# EAGLE design minimalDuino108 (EAGLE 7.4.0)
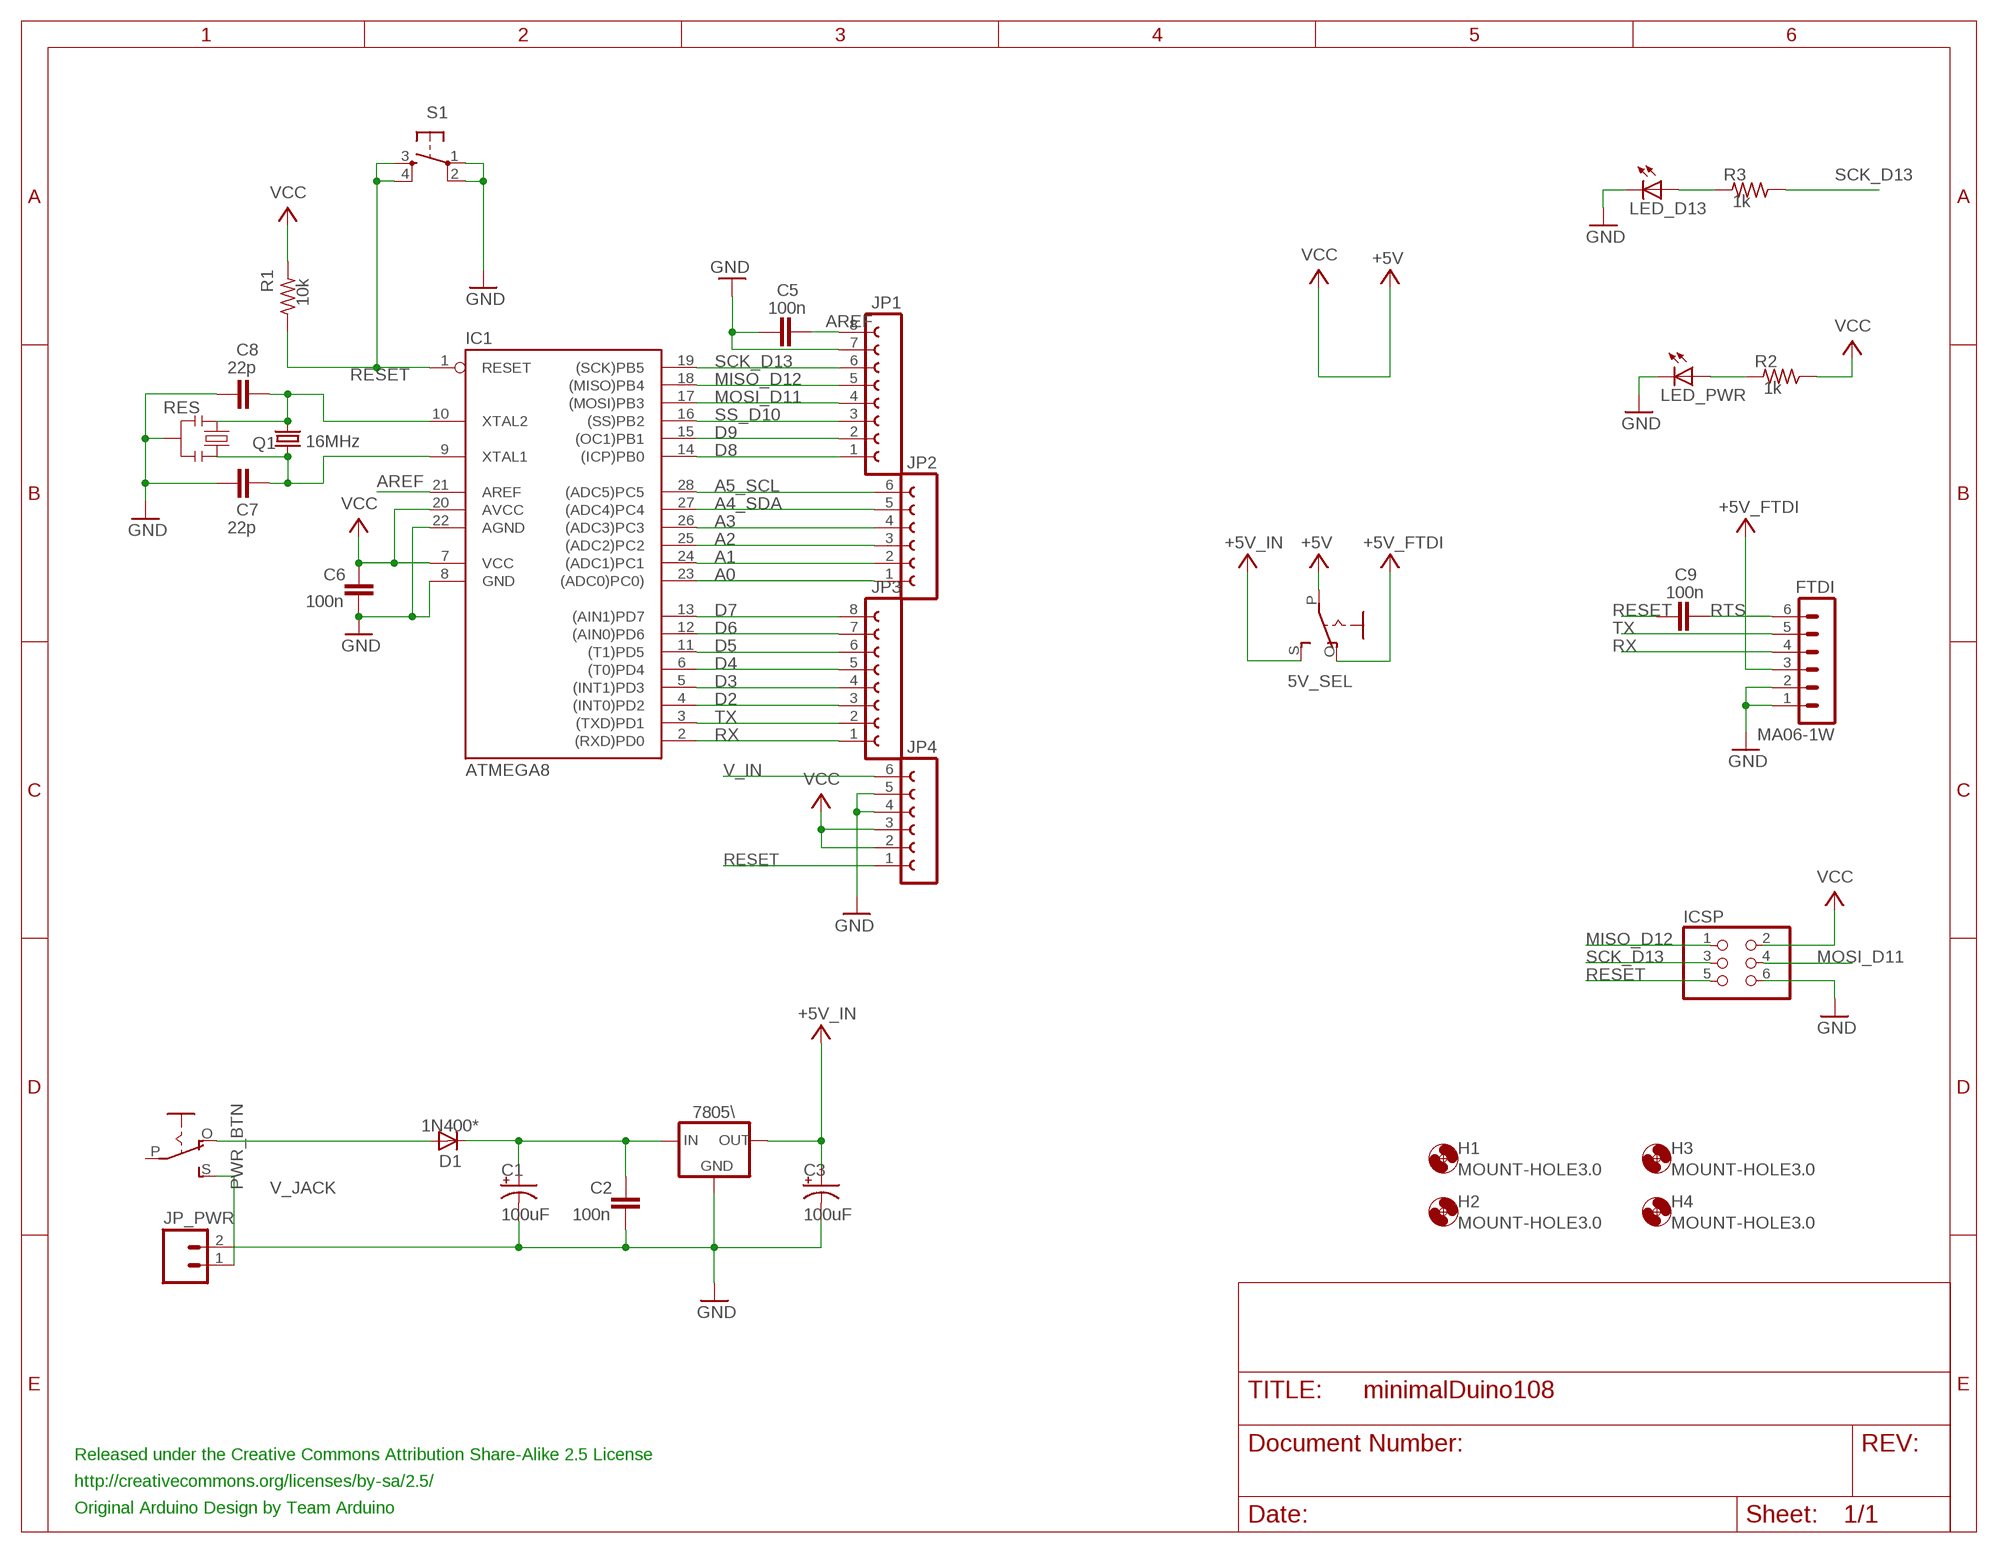
[diagram p0: schematic, sheet 1]

## Parts
5V_SEL  EG1218S  [EG1218]
7805\  V_REG_78XXSIDE  [78XXL]
C1  100uF  CPOL-USE2,5-6E  [E2,5-6E]
C2  100n  C-EU025-025X050  [C025-025X050]
C3  100uF  CPOL-USE2.5-6  [E2,5-6]
C5  100n  C-EU025-025X050  [C025-025X050]
C6  100n  C-EU025-025X050  [C025-025X050]
C7  22p  C-EU025-025X050  [C025-025X050]
C8  22p  C-EU025-025X050  [C025-025X050]
C9  100n  C-EU025-025X050  [C025-025X050]
D1  1N400*  1N4148  [DO35-10]
FTDI  MA06-1W  [MA06-1W]
H1  MOUNT-HOLE3.0  [3,0]
H2  MOUNT-HOLE3.0  [3,0]
H3  MOUNT-HOLE3.0  [3,0]
H4  MOUNT-HOLE3.0  [3,0]
IC1  ATMEGA8  AT90S4433P  [DIL28-3]
ICSP  PINHD-2X3  [2X03]
JP1  FE08-1  [FE08]
JP2  FE06-1  [FE06]
JP3  FE08-1  [FE08]
JP4  FE06-1  [FE06]
JP_PWR  M02PTH  [1X02]
LED_D13  LED3MM  [LED3MM]
LED_PWR  LED3MM  [LED3MM]
PWR_BTN  EG1218S  [EG1218]
Q1  16MHz  CRYSTALHC49S  [HC49/S]
R1  10k  R-US_0204/7  [0204/7]
R2  1k  R-US_0204/7  [0204/7]
R3  1k  R-US_0204/7  [0204/7]
RES  16MHz  RESONATORPTH  [RESONATOR-PTH]
S1  TAC_SWITCHPTH  [TACTILE-PTH]

## Nets
+5V [power]: 5V_SEL.P ; supply symbol labelled VCC
+5V_FTDI [power]: 5V_SEL.O FTDI.3
+5V_IN [power]: 5V_SEL.S 7805\.OUT C3.+
A0: IC1.23((ADC0)PC0)) JP2.1
A1: IC1.24((ADC1)PC1) JP2.2
A2: IC1.25((ADC2)PC2) JP2.3
A3: IC1.26((ADC3)PC3) JP2.4
A4_SDA: IC1.27((ADC4)PC4) JP2.5
A5_SCL: IC1.28((ADC5)PC5) JP2.6
AREF [aref]: C5.2 IC1.21(AREF) JP1.8
D2: IC1.4((INT0)PD2) JP3.3
D3: IC1.5((INT1)PD3) JP3.4
D4: IC1.6((T0)PD4) JP3.5
D5: IC1.11((T1)PD5) JP3.6
D6: IC1.12((AIN0)PD6) JP3.7
D7: IC1.13((AIN1)PD7) JP3.8
D8: IC1.14((ICP)PB0) JP1.1
D9: IC1.15((OC1)PB1) JP1.2
GND: 7805\.GND C1.- C2.2 C3.- C5.1 C6.2 C7.1 C8.1 FTDI.1 FTDI.2 IC1.8(GND) IC1.22(AGND) ICSP.6 JP1.7 JP4.4 JP4.5 JP_PWR.2 LED_D13.K(C) LED_PWR.K(C) RES.2 S1.1 S1.2
MISO_D12: IC1.18((MISO)PB4) ICSP.1 JP1.5
MOSI_D11: IC1.17((MOSI)PB3) ICSP.4 JP1.4
N$1: LED_PWR.A R2.2
N$2: JP_PWR.1 PWR_BTN.S
N$4: LED_D13.A R3.2
N$6: C7.2 IC1.9(XTAL1) Q1.1 RES.3
N$8: C8.2 IC1.10(XTAL2) Q1.2 RES.1
RESET: C9.2 IC1.1(RESET) ICSP.5 JP4.1 R1.1 S1.3 S1.4
RTS: C9.1 FTDI.6
RX: FTDI.4 IC1.2((RXD)PD0) JP3.1
SCK_D13: IC1.19((SCK)PB5) ICSP.3 JP1.6 R3.1
SS_D10: IC1.16((SS)PB2) JP1.3
TX: FTDI.5 IC1.3((TXD)PD1) JP3.2
V_IN [gnd]: 7805\.IN C1.+ C2.1 D1.C JP4.6
V_JACK: D1.A PWR_BTN.O
VCC: C6.1 IC1.7(VCC) IC1.20(AVCC) ICSP.2 JP4.2 JP4.3 R1.2 R2.1
Unconnected: PWR_BTN.P

## Notes on the sheet
- Released under the Creative Commons Attribution Share-Alike 2.5 License
- http://creativecommons.org/licenses/by-sa/2.5/
- Original Arduino Design by Team Arduino

## Library data of the parts
5V_SEL PWR_BTN = adafruit:EG1218: SLIDING SWITCH 0.1" spacing through hole, vertical SPDT slide switch http://www.ladyada.net/library/pcb/eaglelibrary.html
7805\ = SparkFun:V_REG_78XX: Voltage Regulator Standard 7805 5V regulator. IGO (Input Ground Output). Spark Fun Electronics SKU : COM-00107
C1 C3 = rcl_jms:CPOL-US: POLARIZED CAPACITOR, American symbol
C2 C5-C9 = rcl:C-EU: CAPACITOR, European symbol
D1 = diode:1N4148: DIODE high speed (Philips)
FTDI = con-lst-male:MA06-1W: PIN HEADER
H1-H4 = holes:MOUNT-HOLE: MOUNTING HOLE with drill center marker
IC1 = atmel:AT90S4433: MICROCONTROLLER 4 Kbytes FLASH 128 bytes SRAM 256 bytes EEPROM UART 6-channel 10 bit ADC; OC_FARNELL: unknown; OC_NEWARK: unknown
ICSP = pinhead:PINHD-2X3: PIN HEADER
JP1 JP3 = con-lsta:FE08-1: FEMALE HEADER
JP2 JP4 = con-lsta:FE06-1: FEMALE HEADER
JP_PWR = SparkFun:M02: Header 2 Standard 2-pin 0.1" header. Use with straight break away headers (SKU : PRT-00116), right angle break away headers (PRT-00553), swiss pins (PRT-00743), machine pins (PRT-00117), and female headers (PRT-00115). Molex polarized connector foot print use with SKU : PRT-08233 with associated crimp pins and housings.
LED_D13 LED_PWR = led:LED: LED OSRAM: - CHIPLED LG R971, LG N971, LY N971, LG Q971, LY Q971, LO R971, LY R971 LH N974, LH R974 LS Q976, LO Q976, LY Q976 LO Q996 - Hyper CHIPLED LW Q18S LB Q993, LB Q99A, LB R99A - SideLED LS A670, LO A670, LY A670, LG A670, LP A670 LB A673, LV A673, LT A673, LW A673 LH A674 LY A675 LS A676, LA A676, LO A676, LY A676, LW A676 LS A679, LY A679, LG A679 - Hyper Micro SIDELED® LS Y876, LA Y876, LO Y876, LY Y876 LT Y87S - SmartLED LW L88C, LW L88S LB L89C, LB L89S, LG L890 LS L89K, LO L89K, LY L89K LS L896, LA L896, LO L896, LY L896 - TOPLED LS T670, LO T670, LY T670, LG T670, LP T670 LSG T670, LSP T670, LSY T670, LOP T670, LYG T670 LG T671, LOG T671, LSG T671 LB T673, LV T673, LT T673, LW T673 LH T674 LS T676, LA T676, LO T676, LY T676, LB T676, LH T676, LSB T676, LW T676 LB T67C, LV T67C, LT T67C, LS T67K, LO T67K, LY T67K, LW E67C LS E67B, LA E67B, LO E67B, LY E67B, LB E67C, LV E67C, LT E67C LW T67C LS T679, LY T679, LG T679 LS T770, LO T770, LY T770, LG T770, LP T770 LB T773, LV T773, LT T773, LW T773 LH T774 LS E675, LA E675, LY E675, LS T675 LS T776, LA T776, LO T776, LY T776, LB T776 LHGB T686 LT T68C, LB T68C - Hyper Mini TOPLED® LB M676 - Mini TOPLED Santana® LG M470 LS M47K, LO M47K, LY M47K Source: http://www.osram.convergy.de LUXEON: - LUMILED® LXK2-PW12-R00, LXK2-PW12-S00, LXK2-PW14-U00, LXK2-PW14-V00 LXK2-PM12-R00, LXK2-PM12-S00, LXK2-PM14-U00 LXK2-PE12-Q00, LXK2-PE12-R00, LXK2-PE12-S00, LXK2-PE14-T00, LXK2-PE14-U00 LXK2-PB12-K00, LXK2-PB12-L00, LXK2-PB12-M00, LXK2-PB14-N00, LXK2-PB14-P00, LXK2-PB14-Q00 LXK2-PR12-L00, LXK2-PR12-M00, LXK2-PR14-Q00, LXK2-PR14-R00 LXK2-PD12-Q00, LXK2-PD12-R00, LXK2-PD12-S00 LXK2-PH12-R00, LXK2-PH12-S00 LXK2-PL12-P00, LXK2-PL12-Q00, LXK2-PL12-R00 Source: www.luxeon.com KINGBRIGHT: KA-3528ASYC Source: www.kingbright.com
Q1 = crystal:CRYSTAL: CRYSTAL; OC_FARNELL: 1667008; OC_NEWARK: unknown
R1-R3 = rcl:R-US_: RESISTOR, American symbol
RES = SparkFun:RESONATOR: Resonator Small SMD resonator. This is the itty bitty 10/20MHz resonators with built in caps. CSTCE10M0G55 and CSTCE20M0V53. Footprint has been reviewed closely but hasn't been tested yet.
S1 = SparkFun:TAC_SWITCH: Momentary Switch Button commonly used for reset or general input. Spark Fun Electronics SKU : COM-00097

## Net classes
0 default: width 0.203 mm
1 power: width 0.305 mm, drill 0.711 mm, clearance 0.305 mm
2 gnd: width 0.305 mm, drill 0.711 mm, clearance 0.254 mm
3 usbvcc: width 0.508 mm, drill 0.711 mm, clearance 0.254 mm
4 aref: width 0.305 mm

## Board
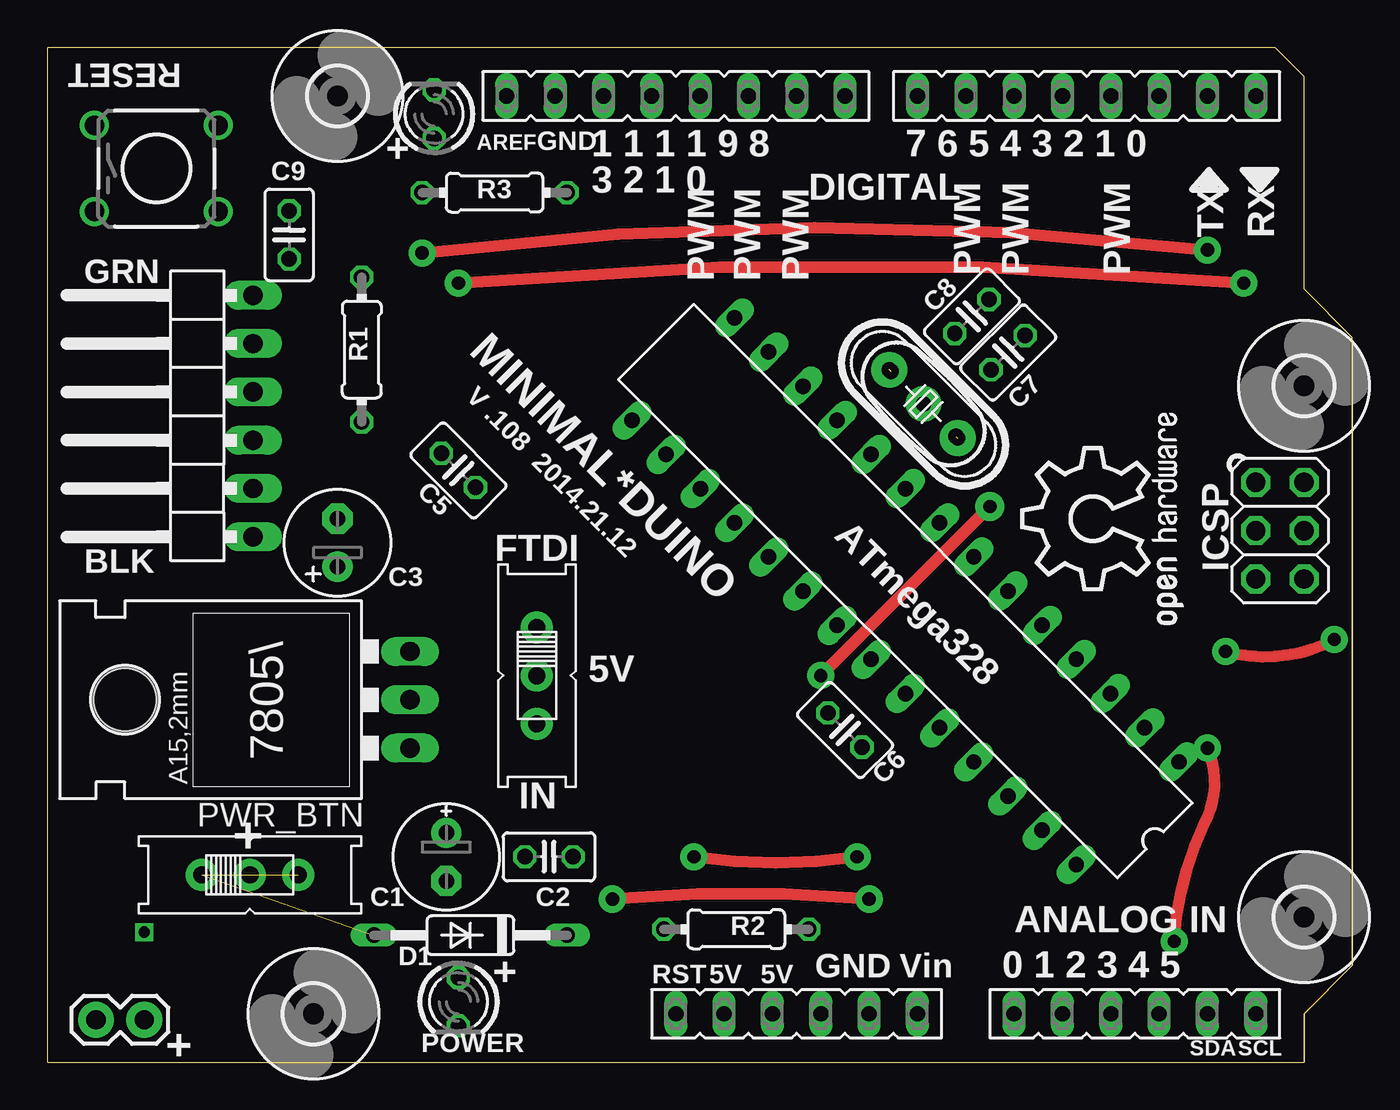
[diagram p1: board, top side]
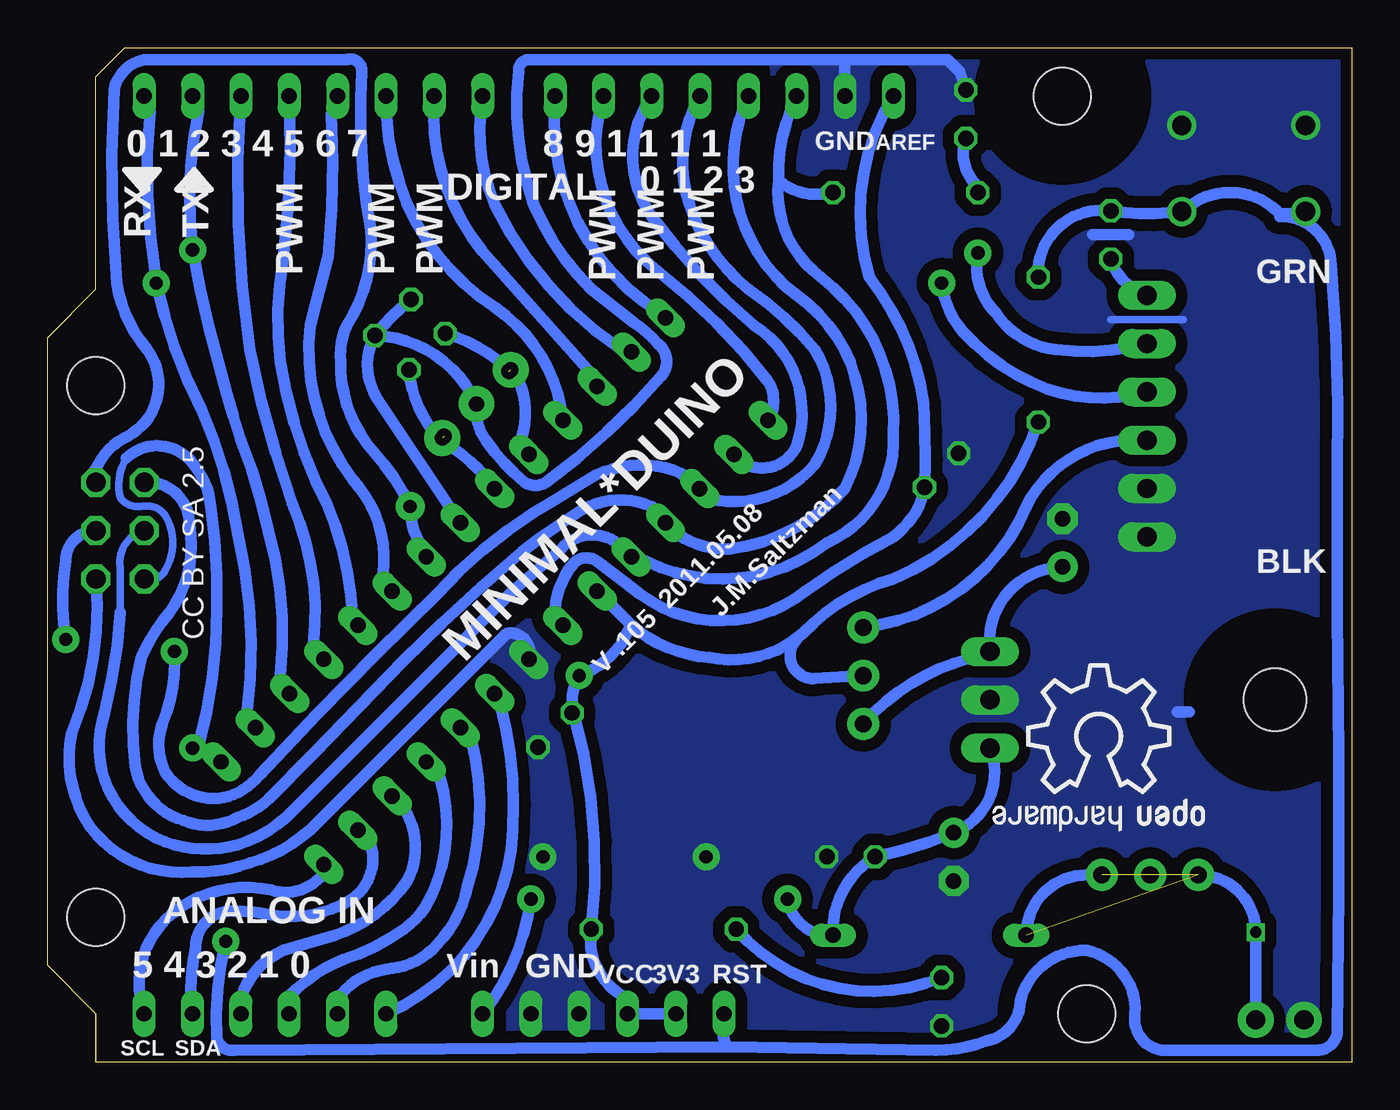
[diagram p2: board, bottom side, seen from below]

Size 68.58 x 53.34 mm. Coordinates in mm from the lower left corner, seen from the top.
Outline: 68.58,5.08 66.04,2.54 66.04,0 0,0 0,53.34 64.14,53.34 64.52,53.34 66.04,51.82 66.04,40.64 68.58,38.1 68.58,5.08
Outline: 68.58,5.08 68.58,5.08
Outline: 66.05,2.54 66.05,0.01
Copper layers (1*16): Top 0.0356mm / dielectric 1.5011mm / Bottom 0.0356mm
Design rules "LaenPCBOrder3": minimum track width 6mil, minimum drill 13mil, track to track 6mil, track to pad 6mil, pad to pad 6mil, via to via 6mil, smd to smd 6mil, copper to edge 15mil, drill to drill 6mil, minimum pad ring 7mil, minimum via ring 7mil, stop-mask expansion 4mil, vias tented up to drill 0mil, thermal gap 10mil

### Footprints (pad centres in the part's own frame; a part is rotated, then mirrored left to right if it is on the bottom)
EG1218 = drill 0.9 pad 1.676: O -2.54,0; P 0,0; S 2.54,0
78XXL = drill 1.016 long: GND 0,-3.81; IN -2.54,-3.81; OUT 2.54,-3.81 | hole 3.302: 0,11.176
E2,5-6E = drill 0.813 pad 1.575: + -1.27,0 | drill 0.813 pad 1.575 octagon: - 1.27,0
C025-025X050 = drill 0.813 octagon: 1 -1.27,0; 2 1.27,0
E2,5-6 = drill 0.813 pad 1.6: + -1.27,0 | drill 0.813 pad 1.6 octagon: - 1.27,0
DO35-10 = drill 0.813 long: A 5.08,0; C -5.08,0
MA06-1W = drill 1.016 long: 1 -6.35,0; 2 -3.81,0; 3 -1.27,0; 4 1.27,0; 5 3.81,0; 6 6.35,0
3,0 = hole 3: 0,0
DIL28-3 = drill 0.813 long: 1 -16.51,-3.81; 2 -13.97,-3.81; 3 -11.43,-3.81; 4 -8.89,-3.81; 5 -6.35,-3.81; 6 -3.81,-3.81; 7 -1.27,-3.81; 8 1.27,-3.81; 9 3.81,-3.81; 10 6.35,-3.81; 11 8.89,-3.81; 12 11.43,-3.81; 13 13.97,-3.81; 14 16.51,-3.81; 15 16.51,3.81; 16 13.97,3.81; 17 11.43,3.81; 18 8.89,3.81; 19 6.35,3.81; 20 3.81,3.81; 21 1.27,3.81; 22 -1.27,3.81; 23 -3.81,3.81; 24 -6.35,3.81; 25 -8.89,3.81; 26 -11.43,3.81; 27 -13.97,3.81; 28 -16.51,3.81
2X03 = drill 1.016 octagon: 1 -2.54,-1.27; 2 -2.54,1.27; 3 0,-1.27; 4 0,1.27; 5 2.54,-1.27; 6 2.54,1.27
FE08 = drill 0.813 long: 1 -8.89,0; 2 -6.35,0; 3 -3.81,0; 4 -1.27,0; 5 1.27,0; 6 3.81,0; 7 6.35,0; 8 8.89,0
FE06 = drill 0.813 long: 1 -6.35,0; 2 -3.81,0; 3 -1.27,0; 4 1.27,0; 5 3.81,0; 6 6.35,0
1X02 = drill 1.016 pad 1.88: 1 0,0; 2 2.54,0
LED3MM = drill 0.813 octagon: A -1.27,0; K 1.27,0
HC49/S = drill 0.813: 1 -2.413,0; 2 2.413,0
0204/7 = drill 0.813 octagon: 1 -3.81,0; 2 3.81,0
RESONATOR-PTH = drill 0.8 pad 1.88: 1 -2.54,0; 2 0,0; 3 2.54,0
TACTILE-PTH = drill 1.016: 1 -3.251,2.261; 2 3.251,2.261; 3 -3.251,-2.261; 4 3.251,-2.261

### Placement (x,y rotation side)
5V_SEL  25.72,20.32 270 top
7805\  15.24,19.05 90 top
C1  20.95,10.79 270 top
C2  26.35,10.79 0 top
C3  15.24,27.3 90 top
C5  21.59,31.11 315 top
C6  41.91,17.46 315 top
C7  50.48,37.31 225 top
C8  48.58,39.21 225 top
C9  12.7,43.5 90 top
D1  22.23,6.67 180 top
FTDI  10.79,33.97 90 top
H1  66.04,7.62 0 top
H2  13.97,2.54 0 top
H3  66.04,35.56 0 top
H4  15.24,50.8 0 top
IC1  45.09,24.77 135 top
ICSP  64.77,27.94 270 top
JP1  33.02,50.8 180 top
JP2  57.15,2.54 0 top
JP3  54.61,50.8 180 top
JP4  39.37,2.54 0 top
JP_PWR  5.08,2.22 180 top
LED_D13  20.32,49.85 90 top
LED_PWR  21.59,3.17 270 top
PWR_BTN  10.64,9.84 0 top
Q1  46.04,34.61 135 top
R1  16.51,37.47 270 top
R2  36.2,6.99 180 top
R3  23.5,45.72 180 top
RES  46.04,34.61 315 top
S1  5.71,46.99 0 top
U$1  [OSHW_TEXT_.3]  58.9,28.58 90 top
U$2  [OSHW_GEAR_HOLLOW_.3]  13.34,17.14 0 bottom
U$3  [OSHW_GEAR_HOLLOW_.3]  54.93,28.57 90 top
U$4  [OSHW_TEXT_.3]  13.34,13.02 180 bottom

### Tracks (layer width: path | path; a pad name or v marks a point on that pad's centre or on a via)
+5V
  Bottom 0.61: 5V_SEL.P 28.26,20.16 arc138 29.21,22.23
+5V_FTDI
  Bottom 0.61: FTDI.3 11.75,32.7 arc-61 17.14,29.21 arc61 5V_SEL.O
+5V_IN
  Bottom 0.61: C3.+ 15.4,26.04 arc-93 7805\.OUT 20.95,20.95 arc-31 5V_SEL.S
A0
  Bottom 0.406: 45.09,19.37 IC1.23
  Bottom 0.61: 45.09,19.37 44.77,18.73 arc18 44.13,12.22 arc65 JP2.1
A1
  Bottom 0.406: 46.88,17.67 46.99,17.78 | 46.88,17.67 IC1.24 | 46.88,17.67 46.79,17.58 46.35,17.14
  Bottom 0.61: JP2.2 53.34,3.33 arc49 50.48,4.92 arc-42 48.1,6.19 arc-32 46.51,9.21 arc-32 46.35,17.14 | 46.79,17.58 IC1.24
A2
  Bottom 0.406: 47.94,14.92 arc-10 IC1.25
  Bottom 0.61: 47.94,14.92 arc36 48.1,9.53 arc37 49.85,6.99 arc17 53.02,5.4 arc-24 55.88,3.49 JP2.3
A3
  Bottom 0.406: 50.47,13.96 IC1.26
  Bottom 0.61: 50.47,13.96 49.85,13.34 arc61 49.69,9.53 arc39 53.5,6.67 56.2,5.87 arc-42 58.26,3.81 JP2.4
A4_SDA
  Bottom 0.406: 51.59,11.43 IC1.27 | 51.59,11.43 | IC1.27 52.7,12.06 | 51.59,11.43 52.2,12.19 IC1.27
  Bottom 0.61: 51.59,11.43 arc86 53.18,8.26 arc38 56.99,7.78 arc-13 58.74,7.94 arc-94 60.8,6.03 arc-20 JP2.5
A5_SCL
  Bottom 0.406: IC1.28 53.98,10.48 54.13,9.84
  Bottom 0.61: JP2.6 arc69 62.07,7.78 arc52 56.83,9.05 arc-68 54.13,9.84
AREF
  Bottom 0.61: IC1.21 41.91,23.81 arc34 40.96,26.19 arc84 39.72,26.35 arc1 37.45,24.61 arc-75 28.73,24.77 arc8 24.13,27.62 arc-44 C5.2 arc-7 22.54,34.61 arc-31 25.4,41.27 arc48 JP1.8
D2
  Bottom 0.406: IC1.4 54.29,21.27 54.61,21.91
  Bottom 0.61: 54.61,21.91 arc-30 55.72,29.37 arc9 57.94,37.47 arc13 JP3.3
D3
  Bottom 0.406: IC1.5 52.55,23.18 52.55,23.34
  Bottom 0.61: 52.55,23.34 arc-26 54.45,30.48 arc16 56.36,36.83 arc16 56.2,42.23 arc-10 JP3.4
D4
  Bottom 0.406: IC1.6 50.96,25.56 | 53.66,49.85 JP3.5
  Bottom 0.61: 50.96,25.56 arc-50 52.55,30.64 arc44 54.77,38.73 arc1 53.82,42.39 arc-8 53.66,49.85
D5
  Bottom 0.61: IC1.11 arc-49 45.09,39.69 arc27 49.21,44.13 arc28 JP3.6
D6
  Bottom 0.406: IC1.12 40.01,36.2 | JP3.7 48.26,50.16
  Bottom 0.61: 40.01,36.2 45.09,41.91 arc48 JP3.7
D7
  Bottom 0.406: IC1.13 38.1,37.47 38.42,37.47
  Bottom 0.61: 38.42,37.47 arc30 45.09,45.09 arc32 JP3.8
D8
  Bottom 0.406: 41.91,50.48 arc23 JP1.1
  Bottom 0.61: IC1.14 36.2,39.22 36.35,39.37 arc63 41.91,50.48
D9
  Bottom 0.61: IC1.15 arc-65 30.72,35.8 arc-15 36.51,41.59 arc69 JP1.2
GND  (via drill 0.7 pad 1.42)
  Top 0.61: v33.97,10.79 arc17 v42.55,10.79
  Bottom 0.406: 8.89,39.05 12.7,39.05
  Bottom 0.61: 26.67,52.7 43.18,52.7 arc-106 43.81,52.07 arc-27 43.02,45.09 arc-22 40.01,40.64 37.78,38.89 arc13 36.51,37.78 arc97 36.35,36.04 arc12 42.39,30.48 arc65 43.5,30.48 arc14 45.56,32.7 arc39 RES.2 arc-63 C7.1 | 11.75,43.5 13.65,43.5 | 26.67,52.7 JP1.7 | LED_D13.K 20.64,52.07 21.27,52.7 26.67,52.7 | IC1.22 arc-121 44.45,22.54 54.77,12.22 arc26 57.94,10.48 arc22 60.96,10 arc59 66.36,12.38 arc46 67.31,17.3 arc-28 ICSP.6 | C7.1 arc13 C8.1 | C7.1 arc-60 51.28,34.92 IC1.8 | 8.57,18.41 9.21,18.41
  pour Bottom (isolate 0.61, no thermals): 0,53.34 30.48,53.34 29.84,34.92 35.88,28.73 45.24,21.75 44.61,16.83 47.47,0 0,0
MISO_D12
  Bottom 0.406: 35.69,27.94 IC1.18 36.1,28.48
  Bottom 0.61: 35.69,27.94 arc-43 32.7,26.99 arc-42 26.67,30.16 arc-82 29.21,40.32 arc41 32.38,45.4 arc36 JP1.5 | 36.1,28.48 36.83,29.21 arc-53 40.48,29.05 arc-7 43.66,26.83 arc-5 49.85,21.11 arc1 56.99,13.81 arc24 58.58,12.86 arc51 61.44,12.7 arc64 63.98,15.56 arc21 63.66,21.27 arc14 62.55,23.18 arc-53 61.12,28.26 arc-96 ICSP.1
MOSI_D11  (via drill 0.7 pad 1.42)
  Top 0.61: v61.91,21.59 arc44 v67.63,22.23
  Bottom 0.406: IC1.17 34,29.84 arc-32 33.34,29.53 | 61.91,21.75 v61.91,21.59
  Bottom 0.61: 33.34,29.53 arc-58 28.26,31.43 arc-62 28.26,37.47 arc-17 31.75,40.64 arc29 34.61,44.45 arc52 JP1.4 | IC1.17 35.27,30.96 arc-55 40.16,30.64 arc2 43.02,28.89 arc-16 48.1,24.61 arc-3 57.47,15.08 arc33 59.05,13.97 arc72 62.39,15.24 arc47 62.55,17.78 arc-27 61.91,21.75 | v67.63,22.23 arc19 67.63,26.35 arc90 ICSP.4
N$1
  Bottom 0.61: LED_PWR.A arc71 R2.2
N$2  (via drill 0.6)  (1 unrouted)
  Bottom 0.61: JP_PWR.1 v5.08,6.83 arc-90 8.1,9.84 | PWR_BTN.S 13.97,9.84 arc-90 17.14,6.67
N$4
  Bottom 0.406: R3.2 19.68,46.04
  Bottom 0.61: 19.68,46.04 arc67 LED_D13.A
N$6  (1 unrouted)
  Bottom 0.406: IC1.9
  Bottom 0.61: IC1.9 arc-25 47.94,32.7 | 47.94,32.7 Q1.1 | 47.94,32.7 arc37 C7.2
N$8  (1 unrouted)
  Bottom 0.406: IC1.10 43.81,32.38 | 43.81,35.88 44.45,36.51 44.65,36.31 Q1.2
  Bottom 0.61: 43.81,32.38 arc-44 43.81,35.88 | 44.45,36.51 arc-25 C8.2
RESET  (via drill 0.7 pad 1.42)
  Top 0.61: v59.21,6.35 arc-23 60.8,12.54 arc51 v60.96,16.51
  Bottom 0.406: 3.87,44.58 3.81,44.45 3.83,44.45 | 3.87,44.58 3.97,44.77 | 2.54,44.73 S1.3 | 2.54,44.73 2.54,44.77 | C9.2 arc-60 12.86,44.77 | 16.51,41.12 R1.1 | 64.45,31.75 arc-42 64.77,29.69 arc-62 63.66,29.21 arc71 62.39,28.73 arc59 62.39,25.88 arc83 ICSP.5 | 60.64,16.67 60.64,16.51 v60.96,16.51 60.18,16.51 IC1.1 | 2.54,44.73 3.87,44.73 3.87,44.58 | 8.89,44.73 S1.4 8.93,44.73 8.89,44.77 8.89,44.73
  Bottom 0.61: 3.97,44.77 arc-85 8.89,44.77 arc20 C9.2 | 3.81,44.45 arc91 1.11,41.91 arc5 0.79,30.96 0.79,23.5 arc2 0.79,1.59 arc90 1.91,0.64 10,0.64 arc92 11.43,2.54 arc-83 13.97,5.87 arc-78 17.46,3.17 arc76 19.21,1.11 arc20 21.91,0.64 32.86,0.79 | v59.21,6.35 arc-16 59.69,1.27 arc-90 58.74,0.64 32.86,0.79 | 32.86,0.79 arc44 JP4.1 | 12.86,44.77 arc-102 16.51,41.12 | 60.64,16.67 arc-16 59.69,23.81 arc-9 60.01,29.21 arc-34 60.8,31.27 arc-103 64.45,31.75
RTS
  Bottom 0.61: FTDI.6 arc56 C9.1
RX  (via drill 0.7 pad 1.42)
  Top 0.61: v21.59,40.96 arc-11 v62.87,40.96
  Bottom 0.406: IC1.2 57.78,17.71 57.78,17.78 58.1,18.26 | 63.63,50.67 JP3.1 63.18,50.01 | v62.87,40.96 62.87,41.12
  Bottom 0.61: v21.59,40.96 arc-34 20.48,38.42 arc-28 16.03,35.4 arc-35 FTDI.4 | v62.87,40.96 arc-15 60.48,34.29 arc14 58.58,27.78 arc20 58.1,18.26 | 62.87,41.12 arc15 63.18,50.01
SCK_D13
  Bottom 0.406: 64.77,23.65 64.77,26.04 arc83 ICSP.3
  Bottom 0.61: 30.16,46.35 arc-59 27.94,41.27 arc56 24.13,33.02 arc69 27.62,27.3 arc65 37.15,26.35 IC1.19 38.49,27.15 arc-91 41.59,26.99 44.13,24.77 arc-1 48.74,20.16 56.04,12.86 arc23 58.58,11.43 arc32 61.91,11.43 arc94 65.56,18.41 arc-10 64.77,23.65 | 30.16,46.35 arc-53 R3.1 | 30.16,46.35 arc28 JP1.6
SS_D10
  Bottom 0.406: 32.38,31.75 32.38,31.82 IC1.16
  Bottom 0.61: 32.38,31.75 arc-106 29.21,32.38 arc-76 31.43,38.73 arc13 36.83,44.45 arc69 JP1.3
TX  (via drill 0.7 pad 1.42)
  Top 0.61: v19.68,42.55 arc-14 v60.96,42.7
  Bottom 0.406: 56.36,20.32 56.2,19.69 IC1.3 | 60.64,50.01 JP3.2
  Bottom 0.61: 56.36,20.32 arc-23 56.99,27.94 arc-11 58.42,32.7 arc2 59.53,36.51 arc7 v60.96,42.7 arc18 60.64,50.01 | v19.68,42.55 arc-56 18.73,39.37 arc-51 15.56,37.47 arc-22 FTDI.5
V_IN  (via drill 0.7 pad 1.42)
  Top 0.61: v29.69,8.57 arc-11 v43.18,8.57
  Bottom 0.406: v43.18,8.57 arc-13 v43.18,8.57
  Bottom 0.61: v43.18,8.57 arc31 JP4.6 | 18.41,16.51 7805\.IN arc90 C1.+ arc11 C2.1 arc-62 D1.C arc84 v29.69,8.57
V_JACK  (1 unrouted)
VCC  (via drill 0.7 pad 1.42, 0.7 pad 1.52)
  Top 0.61: v40.64,20.32 v49.53,29.21
  Bottom 0.406: v40.64,20.32 40.38,20.06 | JP4.3 38.1,3.33
  Bottom 0.61: ICSP.2 arc38 66.04,31.21 arc34 64.61,32.8 arc-104 63.34,37.47 arc32 64.93,40.96 arc9 65.09,51.12 arc67 63.5,52.7 52.86,52.7 arc115 52.07,52.07 arc-7 52.07,47.94 arc-9 51.59,43.81 arc38 52.86,38.73 arc-28 53.18,36.83 arc-42 51.44,32.07 arc18 v49.53,29.21 arc-37 48.74,26.83 48.68,26.77 IC1.7 | 37.94,23.02 arc53 v40.64,20.32 arc-42 40.96,18.41 | 38.1,3.33 arc73 R2.1 arc-23 40.96,18.41 | 40.96,18.41 arc-25 41.12,18.41 40.96,18.41 | R1.2 arc48 24.13,25.4 arc-31 28.89,22.54 arc53 33.81,21.27 arc37 37.94,23.02 | 37.94,23.02 39.69,24.77 IC1.20 | C6.1 40.85,18.36 40.96,18.41 | JP4.2 JP4.3

### Text on the board
tPlace: MINIMAL*DUINO | V .108 2014.21.12 | ATmega328
bPlace: J.M.Saltzman | MINIMAL*DUINO | V .105 2011.05.08
tNames: RESET | AREF | GND | 1 1 1 1 9 8 | 7 6 5 4 3 2 1 0 | + | 3 2 1 0 | DIGITAL | TX | RX | GRN | PWM | PWM | PWM | PWM | PWM | PWM | BLK | FTDI | 5V | + | IN | ANALOG IN | + | RST | 5V | 5V | GND | Vin | 0 1 2 3 4 5 | + | POWER | SDA | SCL
bNames: AREF | GND | 8 9 1 1 1 1 | 0 1 2 3 4 5 6 7 | 0 1 2 3 | DIGITAL | TX | RX | GRN | PWM | PWM | PWM | PWM | PWM | PWM | BLK | CC BY SA 2.5 | ANALOG IN | RST | 3V3 | VCC | GND | Vin | 5 4 3 2 1 0 | SDA | SCL
tValues: D13 | FTDI